# Altium schematic sheet Wireless.SchDoc
size A3; SheetNumber: 7; SheetTotal: 10
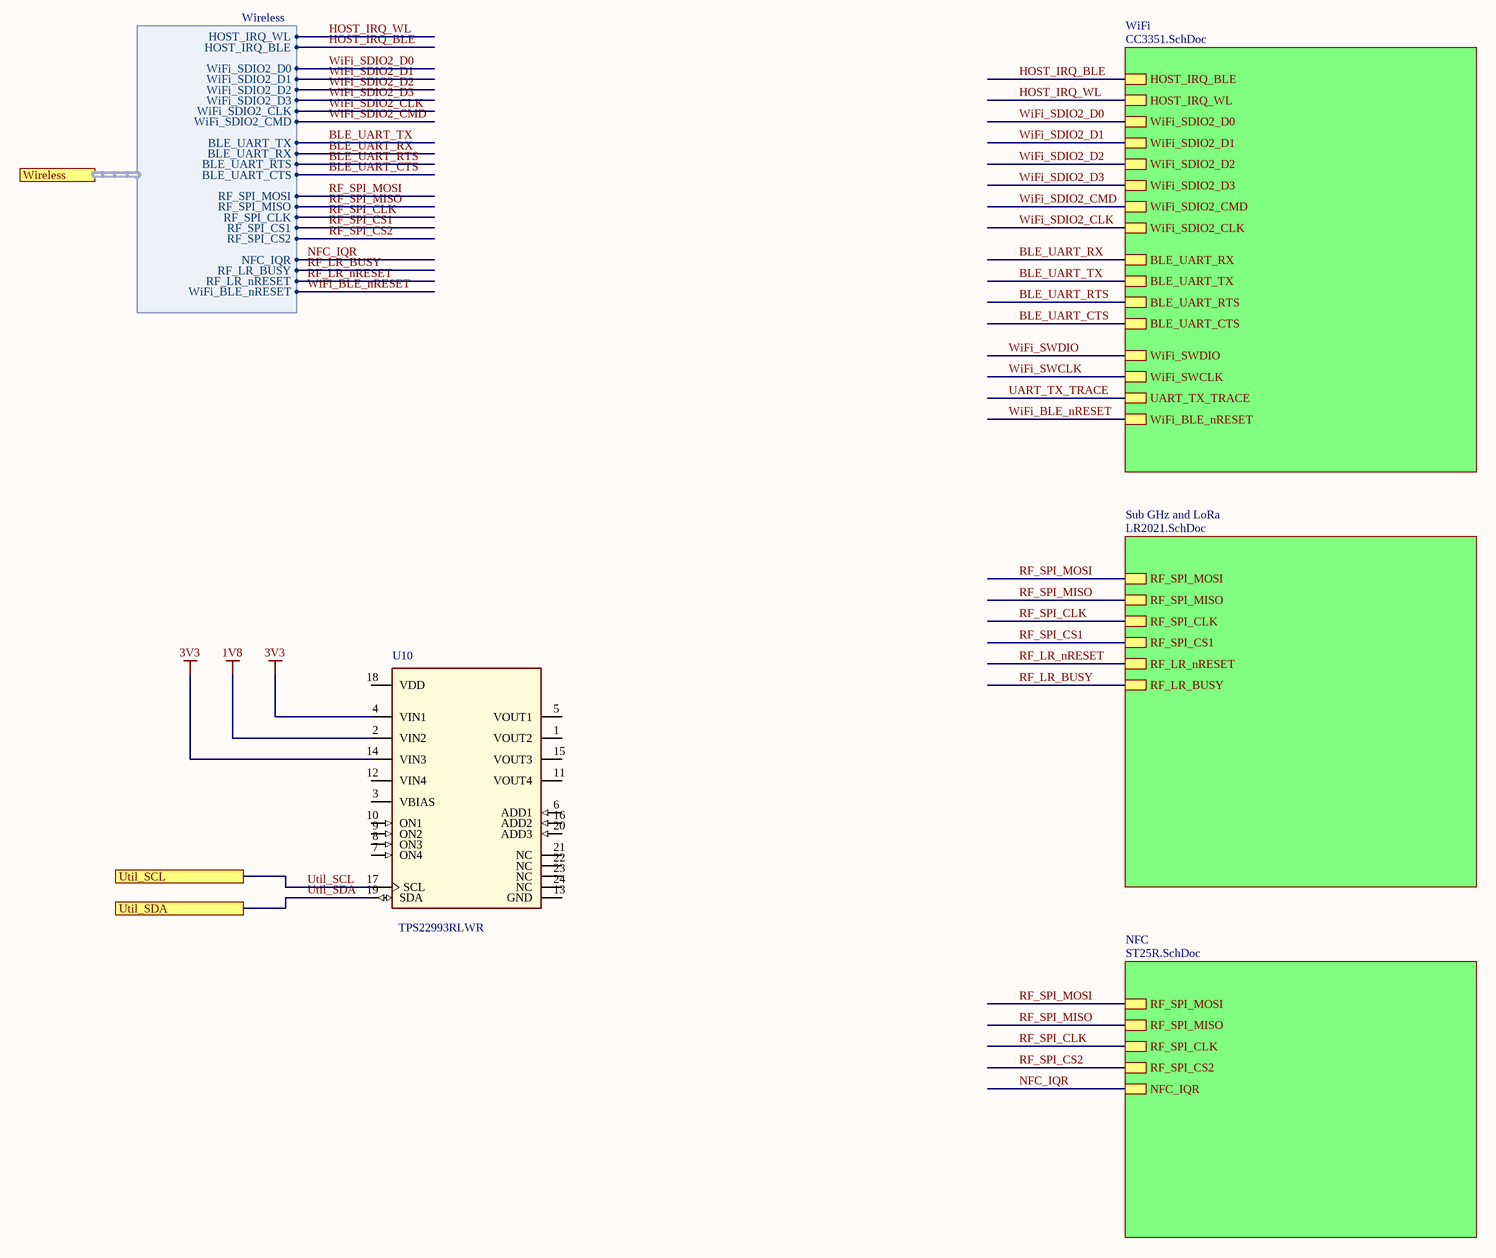
[diagram p0: Wireless.SchDoc]

## Parts
U10  TPS22993RLWR  [FP-RLW0020A-MFG]

## Sub-sheets
NFC = ST25R.SchDoc: RF_SPI_MOSI, RF_SPI_MISO, RF_SPI_CLK, RF_SPI_CS2, NFC_IQR
Sub GHz and LoRa = LR2021.SchDoc: RF_SPI_MOSI, RF_SPI_MISO, RF_SPI_CLK, RF_SPI_CS1, RF_LR_nRESET, RF_LR_BUSY
WiFi = CC3351.SchDoc: HOST_IRQ_BLE, HOST_IRQ_WL, WiFi_SDIO2_D0, WiFi_SDIO2_D1, WiFi_SDIO2_D2, WiFi_SDIO2_D3, WiFi_SDIO2_CMD, WiFi_SDIO2_CLK, BLE_UART_RX, BLE_UART_TX, BLE_UART_RTS, BLE_UART_CTS, WiFi_SWDIO, WiFi_SWCLK, UART_TX_TRACE, WiFi_BLE_nRESET

## Ports
Util_SCL, Util_SDA, Wireless (harness Wireless)

## Harnesses
Wireless: WiFi_SDIO2_D0, WiFi_SDIO2_D1, WiFi_SDIO2_D2, WiFi_SDIO2_D3, WiFi_SDIO2_CLK, WiFi_SDIO2_CMD, BLE_UART_TX, BLE_UART_RX, RF_SPI_MOSI, RF_SPI_CLK, RF_SPI_MISO, RF_SPI_CS1, RF_SPI_CS2, BLE_UART_RTS, BLE_UART_CTS, HOST_IRQ_WL, HOST_IRQ_BLE, NFC_IQR, RF_LR_BUSY, RF_LR_nRESET, WiFi_BLE_nRESET

## Nets
1V8: U10.2(VIN2)
3V3: U10.4(VIN1) U10.14(VIN3)
BLE_UART_CTS: sheet WiFi/BLE_UART_CTS, port Wireless.BLE_UART_CTS
BLE_UART_RTS: sheet WiFi/BLE_UART_RTS, port Wireless.BLE_UART_RTS
BLE_UART_RX: sheet WiFi/BLE_UART_RX, port Wireless.BLE_UART_RX
BLE_UART_TX: sheet WiFi/BLE_UART_TX, port Wireless.BLE_UART_TX
HOST_IRQ_BLE: sheet WiFi/HOST_IRQ_BLE, port Wireless.HOST_IRQ_BLE
HOST_IRQ_WL: sheet WiFi/HOST_IRQ_WL, port Wireless.HOST_IRQ_WL
NFC_IQR: sheet NFC/NFC_IQR, port Wireless.NFC_IQR
RF_LR_BUSY: sheet Sub GHz and LoRa/RF_LR_BUSY, port Wireless.RF_LR_BUSY
RF_LR_nRESET: sheet Sub GHz and LoRa/RF_LR_nRESET, port Wireless.RF_LR_nRESET
RF_SPI_CLK: sheet Sub GHz and LoRa/RF_SPI_CLK, sheet NFC/RF_SPI_CLK, port Wireless.RF_SPI_CLK
RF_SPI_CS1: sheet Sub GHz and LoRa/RF_SPI_CS1, port Wireless.RF_SPI_CS1
RF_SPI_CS2: sheet NFC/RF_SPI_CS2, port Wireless.RF_SPI_CS2
RF_SPI_MISO: sheet Sub GHz and LoRa/RF_SPI_MISO, sheet NFC/RF_SPI_MISO, port Wireless.RF_SPI_MISO
RF_SPI_MOSI: sheet Sub GHz and LoRa/RF_SPI_MOSI, sheet NFC/RF_SPI_MOSI, port Wireless.RF_SPI_MOSI
UART_TX_TRACE: sheet WiFi/UART_TX_TRACE
Util_SCL: U10.17(SCL) ; port Util_SCL
Util_SDA: U10.19(SDA) ; port Util_SDA
WiFi_BLE_nRESET: sheet WiFi/WiFi_BLE_nRESET, port Wireless.WiFi_BLE_nRESET
WiFi_SDIO2_CLK: sheet WiFi/WiFi_SDIO2_CLK, port Wireless.WiFi_SDIO2_CLK
WiFi_SDIO2_CMD: sheet WiFi/WiFi_SDIO2_CMD, port Wireless.WiFi_SDIO2_CMD
WiFi_SDIO2_D0: sheet WiFi/WiFi_SDIO2_D0, port Wireless.WiFi_SDIO2_D0
WiFi_SDIO2_D1: sheet WiFi/WiFi_SDIO2_D1, port Wireless.WiFi_SDIO2_D1
WiFi_SDIO2_D2: sheet WiFi/WiFi_SDIO2_D2, port Wireless.WiFi_SDIO2_D2
WiFi_SDIO2_D3: sheet WiFi/WiFi_SDIO2_D3, port Wireless.WiFi_SDIO2_D3
WiFi_SWCLK: sheet WiFi/WiFi_SWCLK
WiFi_SWDIO: sheet WiFi/WiFi_SWDIO

Not connected (* = marked no-connect by the designer): U10 1(VOUT2) 3(VBIAS) 5(VOUT1) 6(ADD1) 7(ON4) 8(ON3) 9(ON2) 10(ON1) 11(VOUT4) 12(VIN4) 13(GND) 15(VOUT3) 16(ADD2) 18(VDD) 20(ADD3) 21(NC) 22(NC) 23(NC) 24(NC)

## Notes on the sheet
- Project:
- Title:
- Sheet number:
- Revision:
- Designer:
- out of
- Date:

## Library data of the parts
U10 = TPS22993: IC PWR SWITCH N-CHAN 1:1 20WQFN; Number of Outputs: 4; Max Output Current: 1.2A; Interface: I2C; Output Configuration: High Side; Packaging: Tape and Reel; Case/Package: WFQFN; Lead Free: Lead Free; Max Operating Temperature: 85°C; RoHS Compliant: Yes; Number of Channels: 4; Min Operating Temperature: -40°C; Supplier 1: DigiKey; Supplier Part Number 1: 296-51869-1-ND